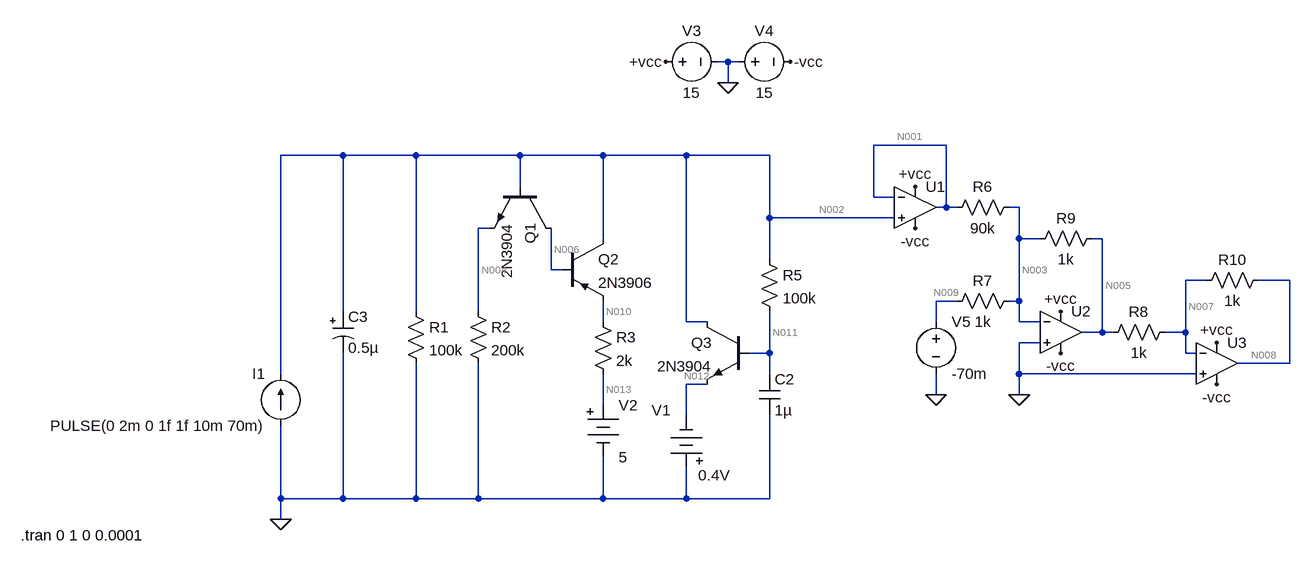
[diagram p0: schematic Modified-FitzHugh-Nagumo-Cell.asc]
Modified-FitzHugh-Nagumo-Cell.asc, the LTspice schematic file:
Version 4
SHEET 1 2272 680
WIRE 544 -336 528 -336
WIRE 560 -336 544 -336
WIRE 544 -304 544 -336
WIRE 880 -208 768 -208
WIRE -48 -192 -144 -192
WIRE 64 -192 -48 -192
WIRE 224 -192 64 -192
WIRE 352 -192 224 -192
WIRE 480 -192 352 -192
WIRE 608 -192 480 -192
WIRE 224 -144 224 -192
WIRE 768 -128 768 -208
WIRE 800 -128 768 -128
WIRE 880 -112 880 -208
WIRE 880 -112 864 -112
WIRE 896 -112 880 -112
WIRE 992 -112 976 -112
WIRE 608 -96 608 -192
WIRE 800 -96 608 -96
WIRE 176 -80 160 -80
WIRE 352 -64 352 -192
WIRE 992 -64 992 -112
WIRE 1024 -64 992 -64
WIRE 1120 -64 1104 -64
WIRE 608 -32 608 -96
WIRE 272 -16 272 -80
WIRE 288 -16 272 -16
WIRE 1280 0 1248 0
WIRE 1408 0 1360 0
WIRE 896 32 864 32
WIRE 992 32 992 -64
WIRE 992 32 976 32
WIRE -48 48 -48 -192
WIRE 64 48 64 -192
WIRE 160 48 160 -80
WIRE 352 64 352 32
WIRE 480 64 480 -192
WIRE 512 64 480 64
WIRE 864 64 864 32
WIRE 992 64 992 32
WIRE 1024 64 992 64
WIRE 1120 80 1120 -64
WIRE 1120 80 1088 80
WIRE 1136 80 1120 80
WIRE 1248 80 1248 0
WIRE 1248 80 1216 80
WIRE 1024 96 992 96
WIRE 608 112 608 48
WIRE 608 112 576 112
WIRE 1248 112 1248 80
WIRE 1264 112 1248 112
WIRE 1408 128 1408 0
WIRE 1408 128 1328 128
WIRE -144 144 -144 -192
WIRE 608 144 608 112
WIRE 992 144 992 96
WIRE 1264 144 992 144
WIRE 512 160 480 160
WIRE 864 176 864 144
WIRE 992 176 992 144
WIRE 352 192 352 144
WIRE 480 208 480 160
WIRE -144 336 -144 224
WIRE -48 336 -48 112
WIRE -48 336 -144 336
WIRE 64 336 64 128
WIRE 64 336 -48 336
WIRE 160 336 160 128
WIRE 160 336 64 336
WIRE 352 336 352 272
WIRE 352 336 160 336
WIRE 480 336 480 288
WIRE 480 336 352 336
WIRE 608 336 608 208
WIRE 608 336 480 336
WIRE -144 368 -144 336
FLAG -144 368 0
FLAG 544 -304 0
FLAG 448 -336 +vcc
FLAG 640 -336 -vcc
FLAG 832 -144 +vcc
FLAG 832 -80 -vcc
FLAG 992 176 0
FLAG 864 176 0
FLAG 1056 112 -vcc
FLAG 1056 48 +vcc
FLAG 1296 160 -vcc
FLAG 1296 96 +vcc
SYMBOL res 48 32 R0
SYMATTR InstName R1
SYMATTR Value 100k
SYMBOL res 144 32 R0
SYMATTR InstName R2
SYMATTR Value 200k
SYMBOL res 336 48 R0
SYMATTR InstName R3
SYMATTR Value 2k
SYMBOL res 592 -48 R0
SYMATTR InstName R5
SYMATTR Value 100k
SYMBOL cap 592 144 R0
SYMATTR InstName C2
SYMATTR Value 1µ
SYMBOL current -144 224 R180
WINDOW 0 24 80 Left 2
WINDOW 3 24 0 Left 2
WINDOW 123 0 0 Left 0
WINDOW 39 0 0 Left 0
SYMATTR InstName I1
SYMATTR Value PULSE(0 2m 0 1f 1f 10m 70m)
SYMBOL npn 272 -144 R90
SYMATTR InstName Q1
SYMATTR Value 2N3904
SYMBOL pnp 288 -64 R0
SYMATTR InstName Q2
SYMATTR Value 2N3906
SYMBOL Misc\\battery 480 304 R180
WINDOW 0 24 104 Left 2
WINDOW 3 -68 4 Left 2
WINDOW 123 0 0 Left 0
WINDOW 39 0 0 Left 0
SYMATTR InstName V1
SYMATTR Value 0.4V
SYMBOL Misc\\battery 352 176 R0
WINDOW 123 0 0 Left 0
WINDOW 39 0 0 Left 0
SYMATTR InstName V2
SYMATTR Value 5
SYMBOL npn 576 64 M0
SYMATTR InstName Q3
SYMATTR Value 2N3904
SYMBOL OpAmps\\UniversalOpAmp 832 -112 R0
SYMATTR InstName U1
SYMBOL OpAmps\\UniversalOpAmp 1056 80 R0
SYMATTR InstName U2
SYMBOL OpAmps\\UniversalOpAmp 1296 128 R0
SYMATTR InstName U3
SYMBOL res 992 -128 R90
WINDOW 0 0 56 VBottom 2
WINDOW 3 32 56 VTop 2
SYMATTR InstName R6
SYMATTR Value 90k
SYMBOL res 992 16 R90
WINDOW 0 0 56 VBottom 2
WINDOW 3 32 56 VTop 2
SYMATTR InstName R7
SYMATTR Value 1k
SYMBOL res 1232 64 R90
WINDOW 0 0 56 VBottom 2
WINDOW 3 32 56 VTop 2
SYMATTR InstName R8
SYMATTR Value 1k
SYMBOL res 1120 -80 R90
WINDOW 0 0 56 VBottom 2
WINDOW 3 32 56 VTop 2
SYMATTR InstName R9
SYMATTR Value 1k
SYMBOL voltage 432 -336 R270
WINDOW 0 32 56 VTop 2
WINDOW 3 -32 56 VBottom 2
WINDOW 123 0 0 Left 0
WINDOW 39 0 0 Left 0
SYMATTR InstName V3
SYMATTR Value 15
SYMBOL voltage 544 -336 R270
WINDOW 0 32 56 VTop 2
WINDOW 3 -32 56 VBottom 2
WINDOW 123 0 0 Left 0
WINDOW 39 0 0 Left 0
SYMATTR InstName V4
SYMATTR Value 15
SYMBOL res 1376 -16 R90
WINDOW 0 0 56 VBottom 2
WINDOW 3 32 56 VTop 2
SYMATTR InstName R10
SYMATTR Value 1k
SYMBOL voltage 864 48 R0
WINDOW 123 0 0 Left 0
WINDOW 39 0 0 Left 0
SYMATTR InstName V5
SYMATTR Value -70m
SYMBOL polcap -64 48 R0
SYMATTR InstName C3
SYMATTR Value 0.5µ
TEXT -544 392 Left 2 !.tran 0 1 0 0.0001

The netlist it stands for:
* Modified-FitzHugh-Nagumo-Cell.asc
R1 N002 0 100k
R2 N004 0 200k
R3 N010 N013 2k
R5 N002 N011 100k
C2 N011 0 1µ
I1 0 N002 PULSE(0 2m 0 1f 1f 10m 70m)
Q1 N006 N002 N004 0 2N3904
Q2 N002 N006 N010 0 2N3906
V1 0 N012 0.4V
V2 N013 0 5
Q3 N002 N011 N012 0 2N3904
XU1 N002 N001 +vcc -vcc N001 level1 Avol=1Meg GBW=10Meg Vos=0 En=0 Enk=0 In=0 Ink=0 Rin=500Meg  ; pins In+ In- V+ V- OUT
XU2 0 N003 +vcc -vcc N005 level1 Avol=1Meg GBW=10Meg Vos=0 En=0 Enk=0 In=0 Ink=0 Rin=500Meg  ; pins In+ In- V+ V- OUT
XU3 0 N007 +vcc -vcc N008 level1 Avol=1Meg GBW=10Meg Vos=0 En=0 Enk=0 In=0 Ink=0 Rin=500Meg  ; pins In+ In- V+ V- OUT
R6 N003 N001 90k
R7 N003 N009 1k
R8 N007 N005 1k
R9 N005 N003 1k
V3 +vcc 0 15
V4 0 -vcc 15
R10 N008 N007 1k
V5 N009 0 -70m
C3 N002 0 0.5µ
.model NPN NPN
.model PNP PNP
.lib standard.bjt
.tran 0 1 0 0.0001
.lib UniversalOpAmp1.lib
.backanno
.end

* Results of the author's LTspice run, read from the files saved beside the schematic
* Operating Point, zero values left out:
*   V(n002) = -4.238 mV
*   V(n010) = 5 V
*   V(n013) = 5 V
*   V(n011) = -4.253 mV
*   V(n006) = 4.687 V
*   V(n012) = -400 mV
*   V(n001) = -4.238 mV
*   V(+vcc) = 15 V
*   V(-vcc) = -15 V
*   V(n003) = -70.06 nV
*   V(n005) = 70.05 mV
*   V(n007) = 70.05 nV
*   V(n008) = -70.05 mV
*   V(n009) = -70 mV
*   Ic(Q2) = -1.907 nA
*   Ib(Q2) = -4.706 pA
*   Ie(Q2) = 1.912 nA
*   Ic(Q3) = 44.15 nA
*   Ib(Q3) = 147.6 pA
*   Ie(Q3) = -44.3 nA
*   Ic(Q1) = 4.698 pA
*   Ib(Q1) = -4.698 pA
*   I(R10) = -70.05 µA
*   I(R9) = 70.05 µA
*   I(R8) = -70.05 µA
*   I(R7) = 70 µA
*   I(R6) = 47.09 nA
*   I(R5) = 147.6 pA
*   I(R3) = -1.912 nA
*   I(R1) = -42.38 nA
*   I(V5) = 70 µA
*   I(V4) = -89.99 nA
*   I(V3) = -90.01 nA
*   I(V2) = -1.912 nA
*   I(V1) = -44.3 nA
*   Ix(u1:1) = -8.476 pA
*   Ix(u1:2) = -8.476 pA
*   Ix(u1:3) = 30.01 nA
*   Ix(u1:4) = -29.99 nA
*   Ix(u1:5) = 45.44 nA
*   Ix(u2:3) = 30 nA
*   Ix(u2:4) = -30 nA
*   Ix(u2:5) = -140.1 µA
*   Ix(u3:3) = 30 nA
*   Ix(u3:4) = -30 nA
*   Ix(u3:5) = 70.05 µA
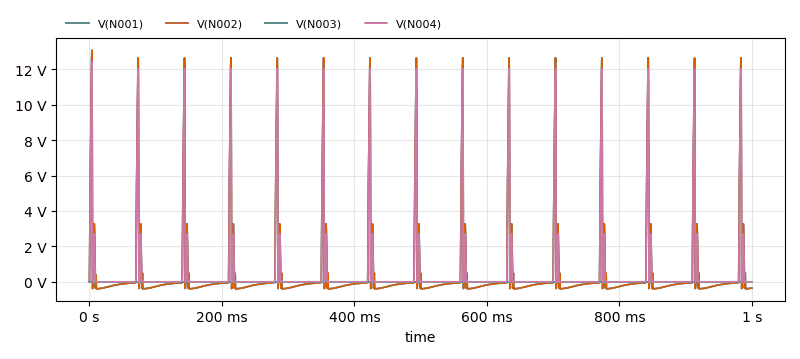
[diagram p1: Transient Analysis of Modified-FitzHugh-Nagumo-Cell.asc, plotted from the saved traces]
* Transient Analysis, 1 run:
*   V(N001): min -393.7 mV, max 13.07 V, average 428.4 mV, rms 2.25 V, last -353.3 mV
*   V(N002): min -393.7 mV, max 13.07 V, average 428.4 mV, rms 2.25 V, last -353.3 mV
*   V(N003): min -3.806 µV, max 1.123 µV, average -65.24 nV, rms 368.2 nV, last -72.63 nV
*   V(N004): min -29.51 mV, max 12.45 V, average 537.4 mV, rms 2.083 V, last 10.41 µV